# EAGLE design FCC3_ProMicro (EAGLE 7.2.0)
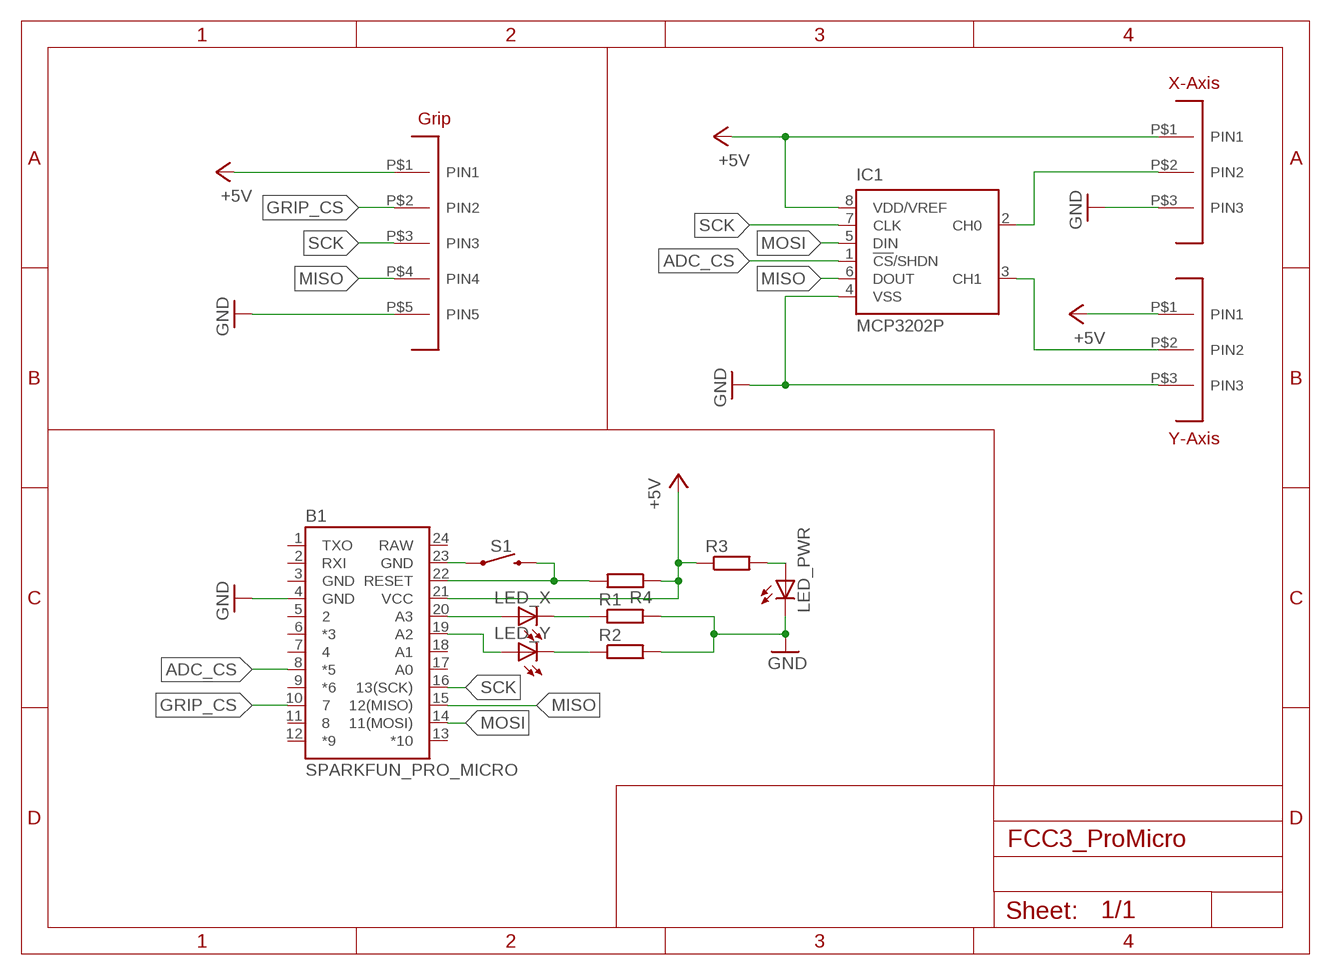
[diagram p0: schematic, sheet 1]

## Parts
B1  SPARKFUN_PRO_MICRO  [SPARKFUN_PRO_MICRO]
IC1  MCP3202P  [DIL8]
LED_PWR  LED3MM  [LED3MM]
LED_X  LED3MM  [LED3MM]
LED_Y  LED3MM  [LED3MM]
R1  R-EU_0204/5  [0204/5]
R2  R-EU_0204/5  [0204/5]
R3  R-EU_0204/5  [0204/5]
R4  R-EU_0204/5  [0204/5]
S1  MOMENTARY-SWITCH-SPST-PTH-6.0MM  [TACTILE_SWITCH_PTH_6.0MM]
U$1  JST_EH_3PIN  [JST-EH-3PIN]
U$2  JST_EH_3PIN  [JST-EH-3PIN]
U$3  JST_EH_5PIN  [JST-EH-5PIN]

## Nets
+5V [Power]: B1.21(VCC) IC1.8(VDD/VREF) R3.1 R4.1 U$1.P$1(PIN1) U$2.P$1(PIN1) U$3.P$1(PIN1)
ADC_CS: B1.8(*5) IC1.1(!CS!/SHDN)
GND [Power]: B1.4(GND) B1.23(GND) IC1.4(VSS) LED_PWR.K(C) R1.2 R2.2 S1.1 U$1.P$3(PIN3) U$2.P$3(PIN3) U$3.P$5(PIN5)
GRIP_CS: B1.10 U$3.P$2(PIN2)
MISO: B1.15(12(MISO)) IC1.6(DOUT) U$3.P$4(PIN4)
MOSI: B1.14(11(MOSI)) IC1.5(DIN)
N$1: IC1.2(CH0) U$2.P$2(PIN2)
N$2: IC1.3(CH1) U$1.P$2(PIN2)
N$3: B1.20(A3) LED_X.A
N$4: B1.19(A2) LED_Y.A
N$5: LED_PWR.A R3.2
N$6: LED_Y.K(C) R2.1
N$7: LED_X.K(C) R1.1
RESET: B1.22(RESET) R4.2 S1.3
SCK: B1.16(13(SCK)) IC1.7(CLK) U$3.P$3(PIN3)
Unconnected: B1.1(TXO) B1.2(RXI) B1.5 B1.6(*3) B1.7 B1.9(*6) B1.11 B1.12(*9) B1.13(*10) B1.17(A0) B1.18(A1)

## Notes on the sheet
- X-Axis
- Grip
- Y-Axis

## Power pins joined to a net without a drawn wire
GND: B1.3(GND)
RAW: B1.24(RAW)

## Library data of the parts
B1 = SparkFun-Boards:SPARKFUN_PRO_MICRO: SparkFun Pro Micro Atmega32U4 compatible footprint. SparkFun Products: 3.3V/8MHz <https://www.sparkfun.com/products/12587> 5V/16MHz <https://www.sparkfun.com/products/12640>
IC1 = microchip:MCP3202: 2.7V Dual Channel 12-Bit A/D Converter with SPI Serial Interface Source: http://ww1.microchip.com/downloads/en/DeviceDoc/21034D.pdf; MF: MICROCHIP; MPN: MCP3202-CI/P; OC_FARNELL: 1196794; OC_NEWARK: 72K7287
LED_PWR LED_X LED_Y = led:LED: LED OSRAM: - CHIPLED LG R971, LG N971, LY N971, LG Q971, LY Q971, LO R971, LY R971 LH N974, LH R974 LS Q976, LO Q976, LY Q976 LO Q996 - Hyper CHIPLED LW Q18S LB Q993, LB Q99A, LB R99A - SideLED LS A670, LO A670, LY A670, LG A670, LP A670 LB A673, LV A673, LT A673, LW A673 LH A674 LY A675 LS A676, LA A676, LO A676, LY A676, LW A676 LS A679, LY A679, LG A679 - Hyper Micro SIDELED® LS Y876, LA Y876, LO Y876, LY Y876 LT Y87S - SmartLED LW L88C, LW L88S LB L89C, LB L89S, LG L890 LS L89K, LO L89K, LY L89K LS L896, LA L896, LO L896, LY L896 - TOPLED LS T670, LO T670, LY T670, LG T670, LP T670 LSG T670, LSP T670, LSY T670, LOP T670, LYG T670 LG T671, LOG T671, LSG T671 LB T673, LV T673, LT T673, LW T673 LH T674 LS T676, LA T676, LO T676, LY T676, LB T676, LH T676, LSB T676, LW T676 LB T67C, LV T67C, LT T67C, LS T67K, LO T67K, LY T67K, LW E67C LS E67B, LA E67B, LO E67B, LY E67B, LB E67C, LV E67C, LT E67C LW T67C LS T679, LY T679, LG T679 LS T770, LO T770, LY T770, LG T770, LP T770 LB T773, LV T773, LT T773, LW T773 LH T774 LS E675, LA E675, LY E675, LS T675 LS T776, LA T776, LO T776, LY T776, LB T776 LHGB T686 LT T68C, LB T68C - Hyper Mini TOPLED® LB M676 - Mini TOPLED Santana® LG M470 LS M47K, LO M47K, LY M47K Source: http://www.osram.convergy.de LUXEON: - LUMILED® LXK2-PW12-R00, LXK2-PW12-S00, LXK2-PW14-U00, LXK2-PW14-V00 LXK2-PM12-R00, LXK2-PM12-S00, LXK2-PM14-U00 LXK2-PE12-Q00, LXK2-PE12-R00, LXK2-PE12-S00, LXK2-PE14-T00, LXK2-PE14-U00 LXK2-PB12-K00, LXK2-PB12-L00, LXK2-PB12-M00, LXK2-PB14-N00, LXK2-PB14-P00, LXK2-PB14-Q00 LXK2-PR12-L00, LXK2-PR12-M00, LXK2-PR14-Q00, LXK2-PR14-R00 LXK2-PD12-Q00, LXK2-PD12-R00, LXK2-PD12-S00 LXK2-PH12-R00, LXK2-PH12-S00 LXK2-PL12-P00, LXK2-PL12-Q00, LXK2-PL12-R00 Source: www.luxeon.com KINGBRIGHT: KA-3528ASYC Source: www.kingbright.com
R1-R4 = resistor:R-EU_: RESISTOR, European symbol
S1 = SparkFun-Switches:MOMENTARY-SWITCH-SPST: Momentary Switch (Pushbutton) - SPST Normally-open (NO) SPST momentary switches (buttons, pushbuttons). Variants PTH-12MM - 12mm square, through-hole Momentary Pushbutton Switch - 12mm Square <https://www.sparkfun.com/products/9190> (COM-09190) PTH-6.0MM, PTH-6.0MM-KIT - 6.0mm square, through-hole Mini Pushbutton Switch <https://www.sparkfun.com/products/97> (COM-00097) KIT package intended for soldering kit's - only one side of pads' copper is exposed. PTH-RIGHT-ANGLE-KIT - Right-angle, through-hole Right Angle Tactile Button <https://www.sparkfun.com/products/10791> - Used on SparkFun BigTime Watch Kit <https://www.sparkfun.com/products/11734> SMD-12MM - 12mm square, surface-mount Tactile Button - SMD (12mm) <https://www.sparkfun.com/products/12993> (COM-12993) Used on SparkFun PicoBoard <https://www.sparkfun.com/products/11888> SMD-4.5MM - 4.5mm Square Trackball Switch Used on SparkFun Blackberry Trackballer Breakout <https://www.sparkfun.com/products/13169> SMD-4.6MMX2.8MM - 4.60mm x 2.80mm, surface mount Used on SparkFun SAMD21 Mini Breakout <https://www.sparkfun.com/products/13664> SMD-5.2MM, SMD-5.2-REDUNDANT - 5.2mm square, surface-mount Mini Pushbutton Switch - SMD <https://www.sparkfun.com/products/8720> (COM-08720) Used on Arduino Pro Mini <https://www.sparkfun.com/products/11114> REDUNDANT package connects both switch circuits together SMD-6.0X3.5MM - 6.0 x 3.5mm, surface mount Momentary Reset Switch SMD <https://www.sparkfun.com/products/8229> (COM-08229) SMD-6.2MM-TALL - 6.2mm square, surface mount Tactile Button - SMD (6mm) <https://www.sparkfun.com/products/12992> Used on SparkFun Digital Sandbox <https://www.sparkfun.com/products/12651> SMD-RIGHT-ANGLE - Right-angle, surface mount Used on SparkFun Block for Intel® Edison - Arduino <https://www.sparkfun.com/products/13036>; PROD_ID: SWCH-08441; SF_SKU: COM-00097
U$1 U$2 = uriba:JST_EH_3PIN
U$3 = uriba:JST_EH_5PIN

## Net classes
0 default: width 0.254 mm, drill 0.254 mm, clearance 0.254 mm
1 Power: width 0.406 mm, drill 0.406 mm, clearance 0.254 mm

## Board
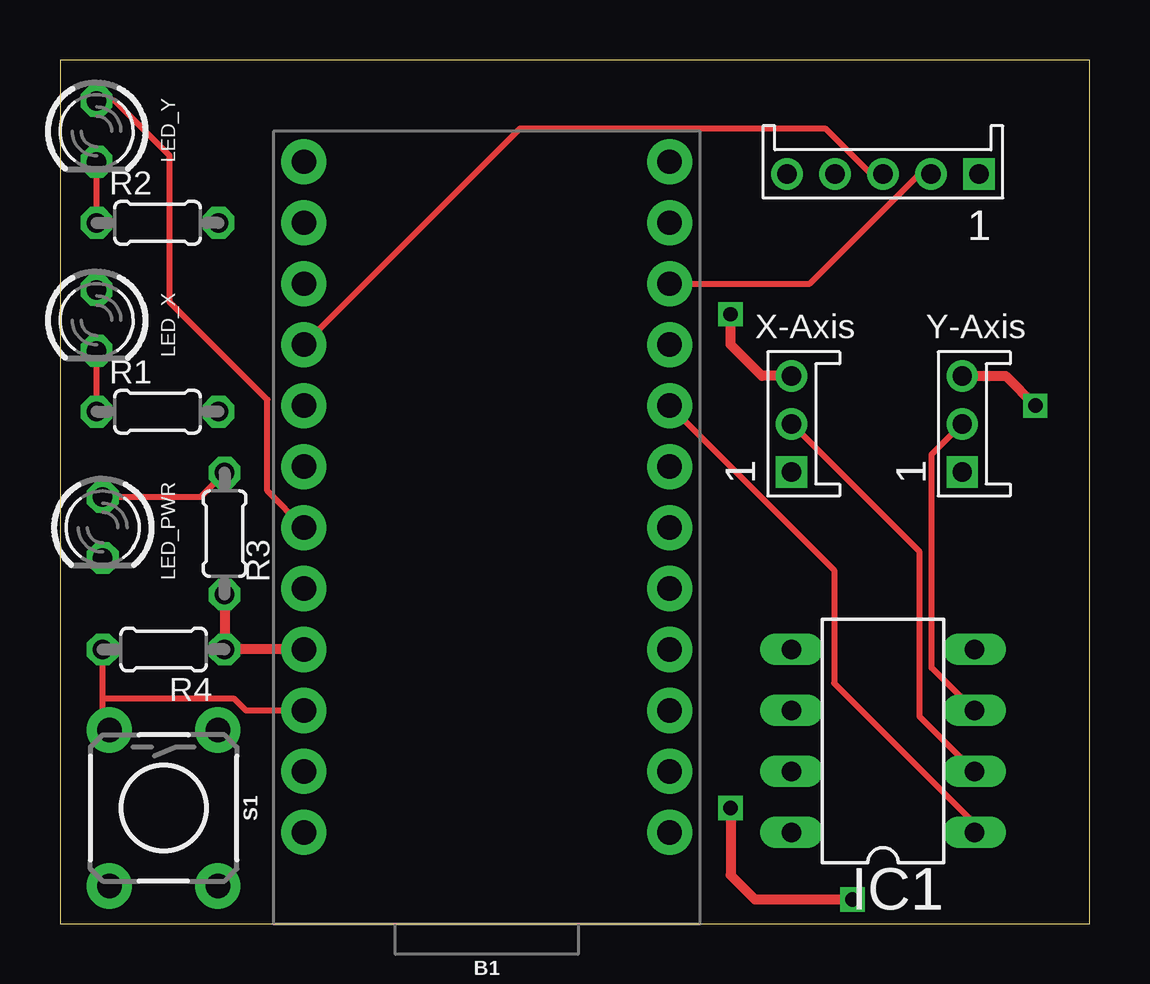
[diagram p1: board, top side]
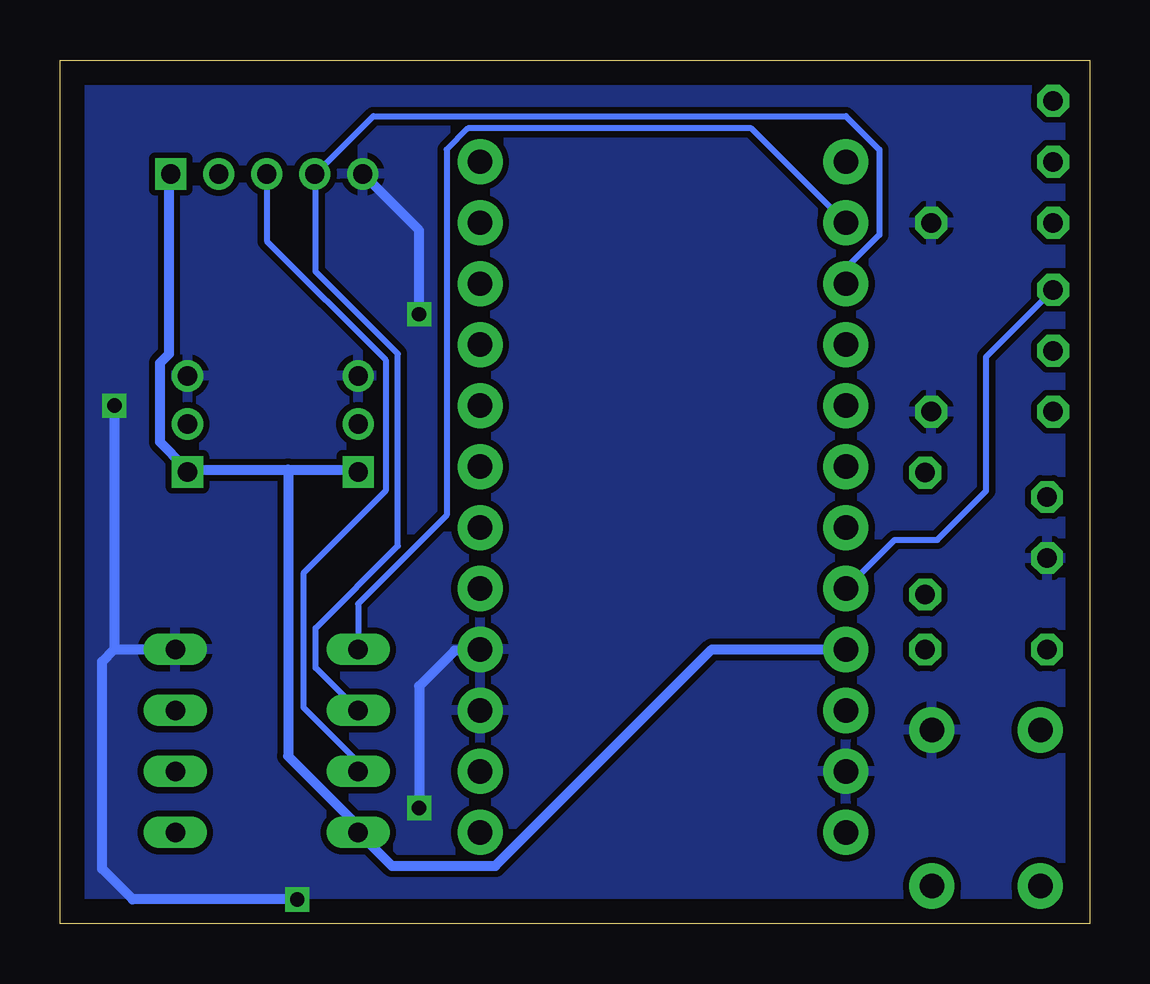
[diagram p2: board, bottom side, seen from below]

Size 42.91 x 35.99 mm. Coordinates in mm from the lower left corner, seen from the top.
Outline: 0,0 42.91,0 42.91,35.99 0,35.99 0,0
Copper layers (1*16): Top 0.035mm / dielectric 1.5mm / Bottom 0.035mm
Design rules "default": minimum track width 10mil, minimum drill 24mil, track to track 8mil, track to pad 8mil, pad to pad 8mil, via to via 8mil, smd to smd 8mil, copper to edge 40mil, drill to drill 8mil, minimum pad ring 10mil, minimum via ring 8mil, stop-mask expansion 4mil, vias tented up to drill 0mil, thermal gap 10mil

### Footprints (pad centres in the part's own frame; a part is rotated, then mirrored left to right if it is on the bottom)
SPARKFUN_PRO_MICRO = drill 1.016 pad 1.88: 1 -7.62,12.7; 2 -7.62,10.16; 3 -7.62,7.62; 4 -7.62,5.08; 5 -7.62,2.54; 6 -7.62,0; 7 -7.62,-2.54; 8 -7.62,-5.08; 9 -7.62,-7.62; 10 -7.62,-10.16; 11 -7.62,-12.7; 12 -7.62,-15.24; 13 7.62,-15.24; 14 7.62,-12.7; 15 7.62,-10.16; 16 7.62,-7.62; 17 7.62,-5.08; 18 7.62,-2.54; 19 7.62,0; 20 7.62,2.54; 21 7.62,5.08; 22 7.62,7.62; 23 7.62,10.16; 24 7.62,12.7
DIL8 = drill 0.813 long: 1 -3.81,-3.81; 2 -1.27,-3.81; 3 1.27,-3.81; 4 3.81,-3.81; 5 3.81,3.81; 6 1.27,3.81; 7 -1.27,3.81; 8 -3.81,3.81
LED3MM = drill 0.813 octagon: A -1.27,0; K 1.27,0
0204/5 = drill 0.813 octagon: 1 -2.54,0; 2 2.54,0
TACTILE_SWITCH_PTH_6.0MM = drill 1.016 pad 1.88: 1 -3.251,2.261; 2 3.251,2.261; 3 -3.251,-2.261; 4 3.251,-2.261
JST-EH-3PIN = drill 0.8 square: P$1 2,0 | drill 0.8: P$2 0,0; P$3 -2,0
JST-EH-5PIN = drill 0.8 square: P$1 4,0 | drill 0.8: P$2 2,0; P$3 0,0; P$4 -2,0; P$5 -4,0

### Placement (x,y rotation side)
B1  17.78,16.51 180 top
IC1  34.29,7.62 90 top
LED_PWR  1.78,16.51 270 top
LED_X  1.52,25.15 270 top
LED_Y  1.52,33.02 270 top
R1  4.06,21.34 0 top
R2  4.06,29.21 0 top
R3  6.86,16.26 90 top
R4  4.32,11.43 180 top
S1  4.32,4.83 270 top
U$1  37.59,20.83 270 top
U$2  30.48,20.83 270 top
U$3  34.29,31.24 0 top

### Tracks (layer width: path | path; a pad name or v marks a point on that pad's centre or on a via)
+5V
  Top 0.406: R3.1 R4.1 B1.21
  Bottom 0.406: 33.4,18.92 37.59,18.92 U$1.P$1 37.72,19.05 38.73,20.07 38.73,23.37 38.35,23.75 38.35,31.24 U$3.P$1 | 33.4,18.92 30.48,18.92 U$2.P$1 | 33.4,18.92 33.4,6.99 30.48,4.06 IC1.8 29.08,2.41 24.77,2.41 15.75,11.43 B1.21
ADC_CS
  Top 0.254: IC1.1 38.1,4.19 32.26,10.03 32.26,14.73 B1.8
GND  (via drill 0.6)
  Top 0.406: U$1.P$3 39.4,22.83 v40.64,21.59 | U$2.P$3 29.24,22.83 27.94,24.13 v27.94,25.4 | v27.94,4.83 27.94,2.03 28.96,1.02 v33.02,1.02
  Bottom 0.406: 25.4,9.02 B1.3 | v40.64,21.59 40.64,11.43 | 40.64,11.43 IC1.4 | v27.94,25.4 27.94,28.89 U$3.P$5 | 25.35,11.38 26.47,11.38 27.94,9.91 v27.94,4.83 | v33.02,1.02 39.88,1.02 41.15,2.29 41.15,10.92 40.64,11.43
  pour Bottom: -2.54,38.86 46.23,38.86 46.48,-3.05 -2.29,-3.05
GRIP_CS
  Top 0.254: U$3.P$2 35.81,31.24 31.24,26.67 B1.10
MISO
  Bottom 0.254: 32.26,31.24 32.26,27.18 28.83,23.75 28.83,15.75 32.26,12.32 32.26,10.67 IC1.6 | B1.15 10.16,27.3 8.76,28.7 8.76,32.26 10.16,33.66 29.84,33.66 32.26,31.24 | 32.26,31.24 U$3.P$4
MOSI
  Bottom 0.254: IC1.5 30.48,13.34 26.8,17.02 26.8,32.26 25.91,33.15 14.1,33.15 B1.14
N$1
  Top 0.254: U$2.P$2 35.81,15.49 35.81,8.64 IC1.2
N$2
  Top 0.254: U$1.P$2 36.32,19.56 36.32,10.67 IC1.3
N$3
  Bottom 0.254: B1.20 8.13,16 6.35,16 4.32,18.03 4.32,23.62 LED_X.A
N$4
  Top 0.254: B1.19 8.64,18.03 8.64,21.84 4.57,25.91 4.57,32 2.29,34.29 LED_Y.A
N$5
  Top 0.254: LED_PWR.A 5.84,17.78 R3.2
N$6
  Top 0.254: R2.1 LED_Y.K
N$7
  Top 0.254: R1.1 LED_X.K
RESET
  Top 0.254: 1.78,9.4 1.78,8.38 2.03,8.13 S1.3 | 1.78,9.4 R4.2 | B1.22 7.75,8.89 7.24,9.4 1.78,9.4
SCK
  Top 0.254: U$3.P$3 33.78,31.24 31.88,33.15 19.18,33.15 B1.16
  Bottom 0.254: IC1.7 30.48,6.73 32.77,9.02 32.77,14.61 29.34,18.03 29.34,23.5 34.29,28.45 U$3.P$3

### Text on the board
tNames: X-Axis | Y-Axis